# EAGLE design Fog_DRL_Cam (EAGLE 8.2.2)
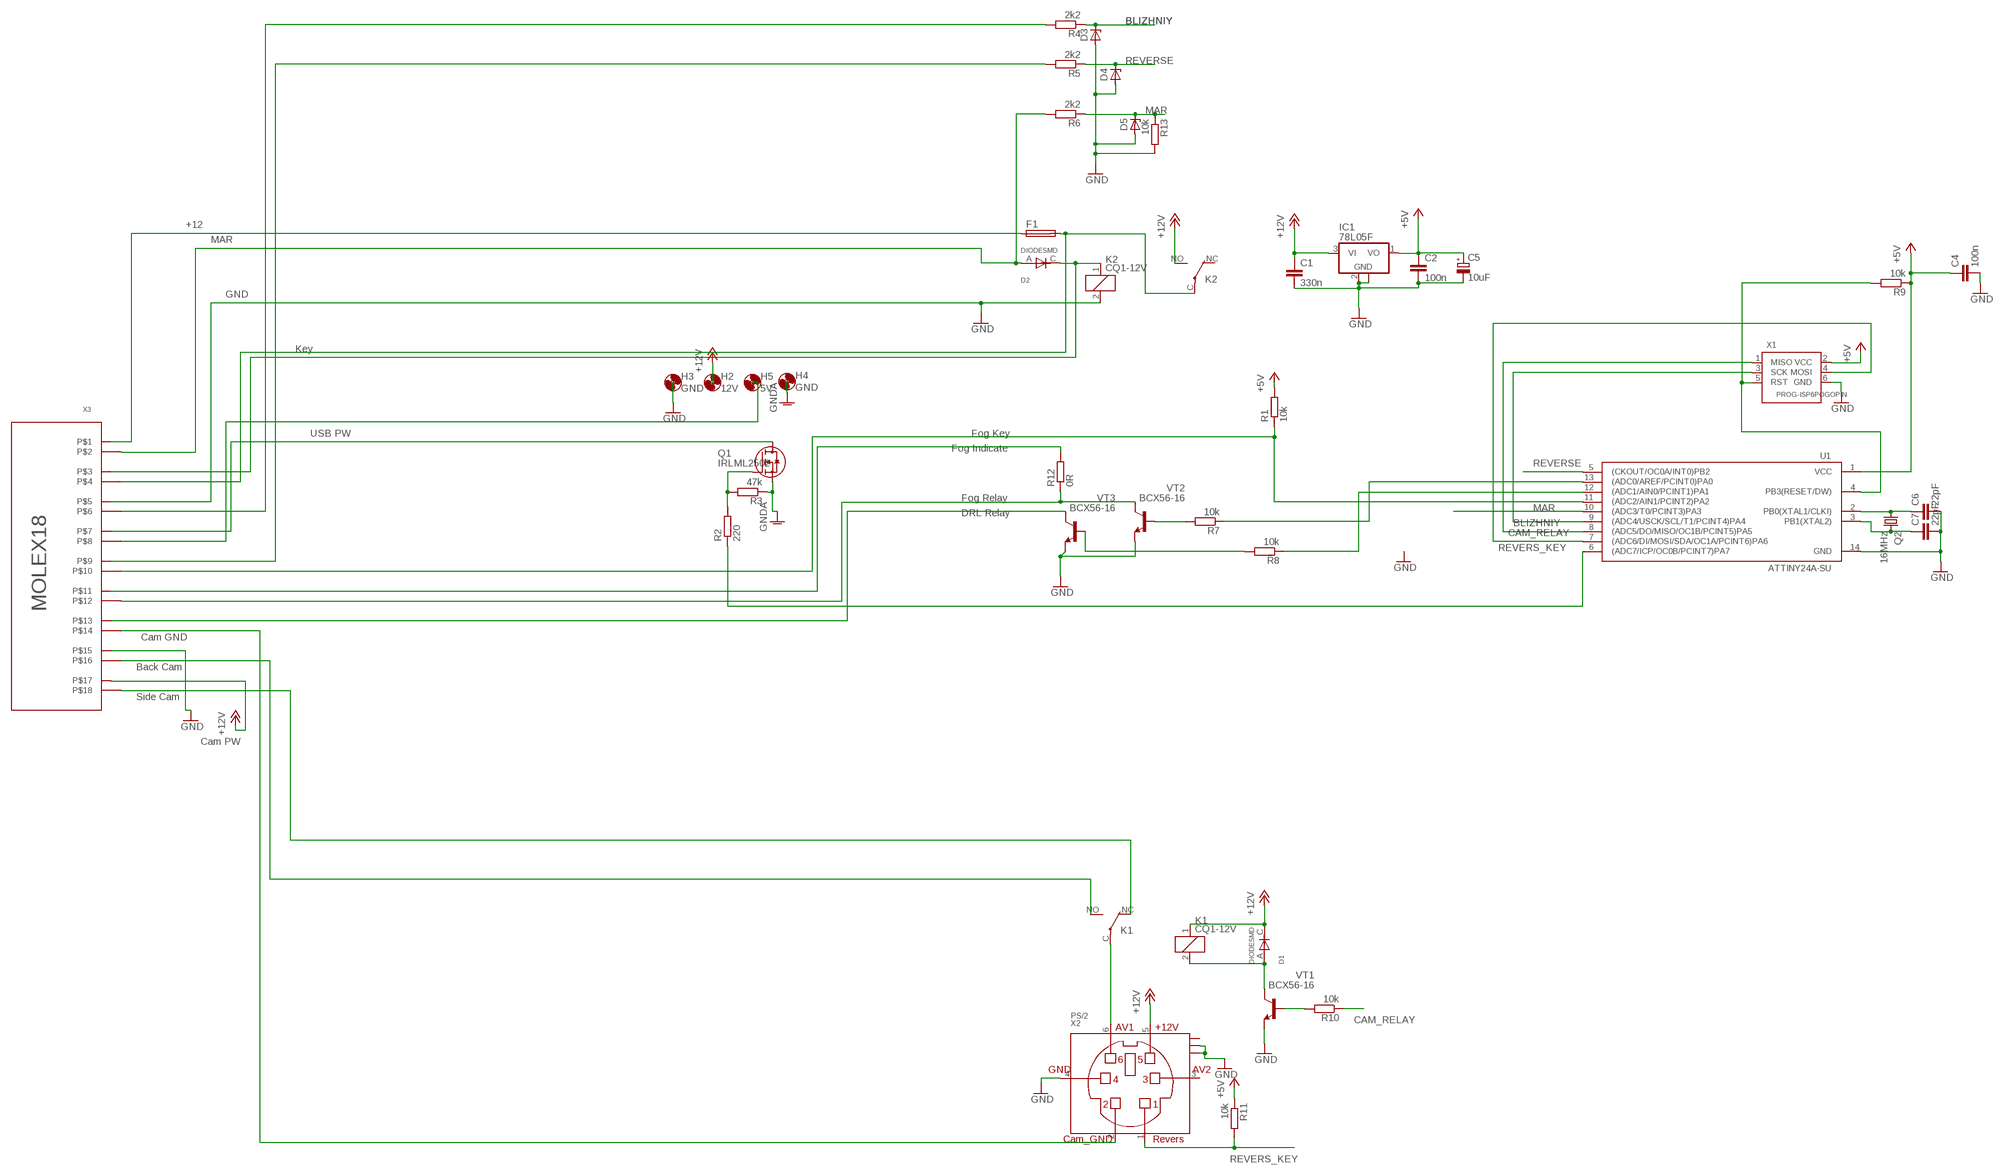
[diagram p0: schematic, sheet 1]

## Parts
C1  330n  C-EUC0805  [C0805]
C2  100n  C-EUC0603  [C0603]
C4  100n  C-EUC0603  [C0603]
C5  10uF  CPOL-EUCT3216  [CT3216]
C6  22pF  C-EUC0603  [C0603]
C7  22pF  C-EUC0603  [C0603]
D1  DIODESMD  [DO214AC]
D2  DIODESMD  [DO214AC]
D3  ZENER-DIODESOD80C  [SOD80C]
D4  ZENER-DIODESOD80C  [SOD80C]
D5  ZENER-DIODESOD80C  [SOD80C]
F1  SH22,5A  [SH22,5A]
H2  12V  MOUNT-HOLE3.0  [3,0]
H3  GND  MOUNT-HOLE3.0  [3,0]
H4  GND  MOUNT-HOLE3.0  [3,0]
H5  5V  MOUNT-HOLE3.0  [3,0]
IC1  78L05F  [SOT89]
K1  CQ1-12V  [CQ1]
K2  CQ1-12V  [CQ1]
Q1  IRLML2502  SI2302  [SOT-23-GSD]
Q2  16MHz  CRYSTALHC49S  [HC49/S]
R1  10k  R-EU_R0603  [R0603]
R2  220  R-EU_R0603  [R0603]
R3  47k  R-EU_R0603  [R0603]
R4  2k2  R-EU_R0603  [R0603]
R5  2k2  R-EU_R0603  [R0603]
R6  2k2  R-EU_R0603  [R0603]
R7  10k  R-EU_R0603  [R0603]
R8  10k  R-EU_R0603  [R0603]
R9  10k  R-EU_R0603  [R0603]
R10  10k  R-EU_R0603  [R0603]
R11  10k  R-EU_R0603  [R0603]
R12  0R  R-EU_R0603  [R0603]
R13  10k  R-EU_R0603  [R0603]
U1  ATTINY24A-SU  [SO14]
VT1  BCX56-16  [SOT89-BCE]
VT2  BCX56-16  [SOT89-BCE]
VT3  BCX56-16  [SOT89-BCE]
X1  PROG-ISP6POGOPIN  [PROG_POGOPIN]
X2  PS/2  [PS/2]
X3  MOLEX18  [MOLEX18]

## Nets
+5V: C2.1 C4.1 C5.+ IC1.1(VO) R1.2 R9.1 R11.1 U1.1(VCC) X1.2(VCC)
+12V: C1.1 D1.C(KATOD) H2.P$1 IC1.3(VI) K1.1 K2.NO(2:S) X2.5 X3.P$17
BLIZHNIY: D3.C R4.1 U1.9((ADC4/USCK/SCL/T1/PCINT4)PA4) X1.3(SCK)
CAM_RELAY: R10.1 U1.8((ADC5/DO/MISO/OC1B/PCINT5)PA5) X1.1(MISO)
GND: C1.2 C2.2 C4.2 C5.- C6.2 C7.2 D3.A D4.A D5.A H3.P$1 IC1.2(GND) IC1.2@1(GND) K2.2 R13.2 U1.14(GND) VT1.E VT2.E VT3.E X1.6(GND) X2.4 X2.GND0 X2.GND2 X3.P$5 X3.P$15
GNDA: H4.P$1 Q1.S R3.1
MAR: D5.C R6.1 R13.1 U1.10((ADC3/T0/PCINT3)PA3)
N$1: K1.NO(2:S) X3.P$16
N$2: R12.2 X3.P$11
N$3: X2.2 X3.P$14
N$4: K1.C(2:P) X2.6
N$5: D1.A(ANOD) K1.2 VT1.C VT1.C@1(C)
N$6: F1.1 X3.P$1
N$7: H5.P$1 X3.P$8
N$8: Q1.D X3.P$7
N$11: F1.2 K2.C(2:P) X3.P$4
N$12: D2.C(KATOD) K2.1 X3.P$3
N$13: D2.A(ANOD) R6.2 X3.P$2
N$14: R2.1 U1.6((ADC7/ICP/OC0B/PCINT7)PA7)
N$15: VT3.C VT3.C@1(C) X3.P$13
N$16: R12.1 VT2.C VT2.C@1(C) X3.P$12
N$17: R8.1 U1.12((ADC1/AIN0/PCINT1)PA1)
N$18: R7.1 U1.13((ADC0/AREF/PCINT0)PA0)
N$19: R1.1 U1.11((ADC2/AIN1/PCINT2)PA2) X3.P$10
N$20: Q1.G R2.2 R3.2
N$21: R5.2 X3.P$9
N$22: R4.2 X3.P$6
N$25: R7.2 VT2.B
N$26: R8.2 VT3.B
N$27: C6.1 Q2.1 U1.2(PB0(XTAL1/CLKI))
N$28: R10.2 VT1.B
N$31: K1.NC(2:O) X3.P$18
N$38: R9.2 U1.4(PB3(RESET/DW)) X1.5(RST)
N$39: C7.1 Q2.2 U1.3(PB1(XTAL2))
REVERS_KEY: R11.2 U1.7((ADC6/DI/MOSI/SDA/OC1A/PCINT6)PA6) X1.4(MOSI) X2.1
REVERSE: D4.C R5.1 U1.5((CKOUT/OC0A/INT0)PB2)
Unconnected: K2.NC(2:O) X2.3 X2.GND1

## Notes on the sheet
- +12
- MAR
- GND
- Key
- USB PW | Fog Key
- Fog Indicate
- Fog Relay
- DRL Relay
- Cam GND
- Back Cam
- Side Cam
- Cam PW

## Library data of the parts
C1 C2 C4 C6 C7 = rcl:C-EU: CAPACITOR, European symbol
C5 = rcl:CPOL-EU: POLARIZED CAPACITOR, European symbol
D1 D2 = usb:DIODE: DIODE
D3-D5 = diode:ZENER-DIODE: Z-Diode
F1 = fuse:SH22,5A: FUSE HOLDER grid 22,5mm, isolated cap OGN0031 8201, Schurter (Buerklin); MPN: 0031.7701.11; OC_FARNELL: unknown; OC_NEWARK: 04F1224
H2-H5 = holes:MOUNT-HOLE: MOUNTING HOLE with drill center marker
IC1 = linear:78L*: POSITOIV-VOLTAGE REGULATORS Output up to 100 mA Source: Datasheet <http://focus.ti.com/lit/ds/symlink/ua78l05.pdf>
K1 K2 = relay:CQ1-12V: AUTOMOTIVE QUIET RELAY NAiS Source: http://www.mew-europe.com/.. en_ds_61208_0000.pdf; OC_FARNELL: unknown; OC_NEWARK: unknown
Q1 = usb:SI2302: N-канальный полевик
Q2 = crystal:CRYSTAL: CRYSTAL; OC_FARNELL: 1667008; OC_NEWARK: unknown
R1-R13 = rcl:R-EU_: RESISTOR, European symbol
U1 = usb:ATTINY24A: ATTiny24A ATTiny44A ATTiny84A
VT1-VT3 = usb:BCX56-16
X1 = usb:PROG-ISP
X2 = usb:PS/2: MINI DIN JACK DIP 90° WITH SHIELD
X3 = usb:MOLEX18

## Board
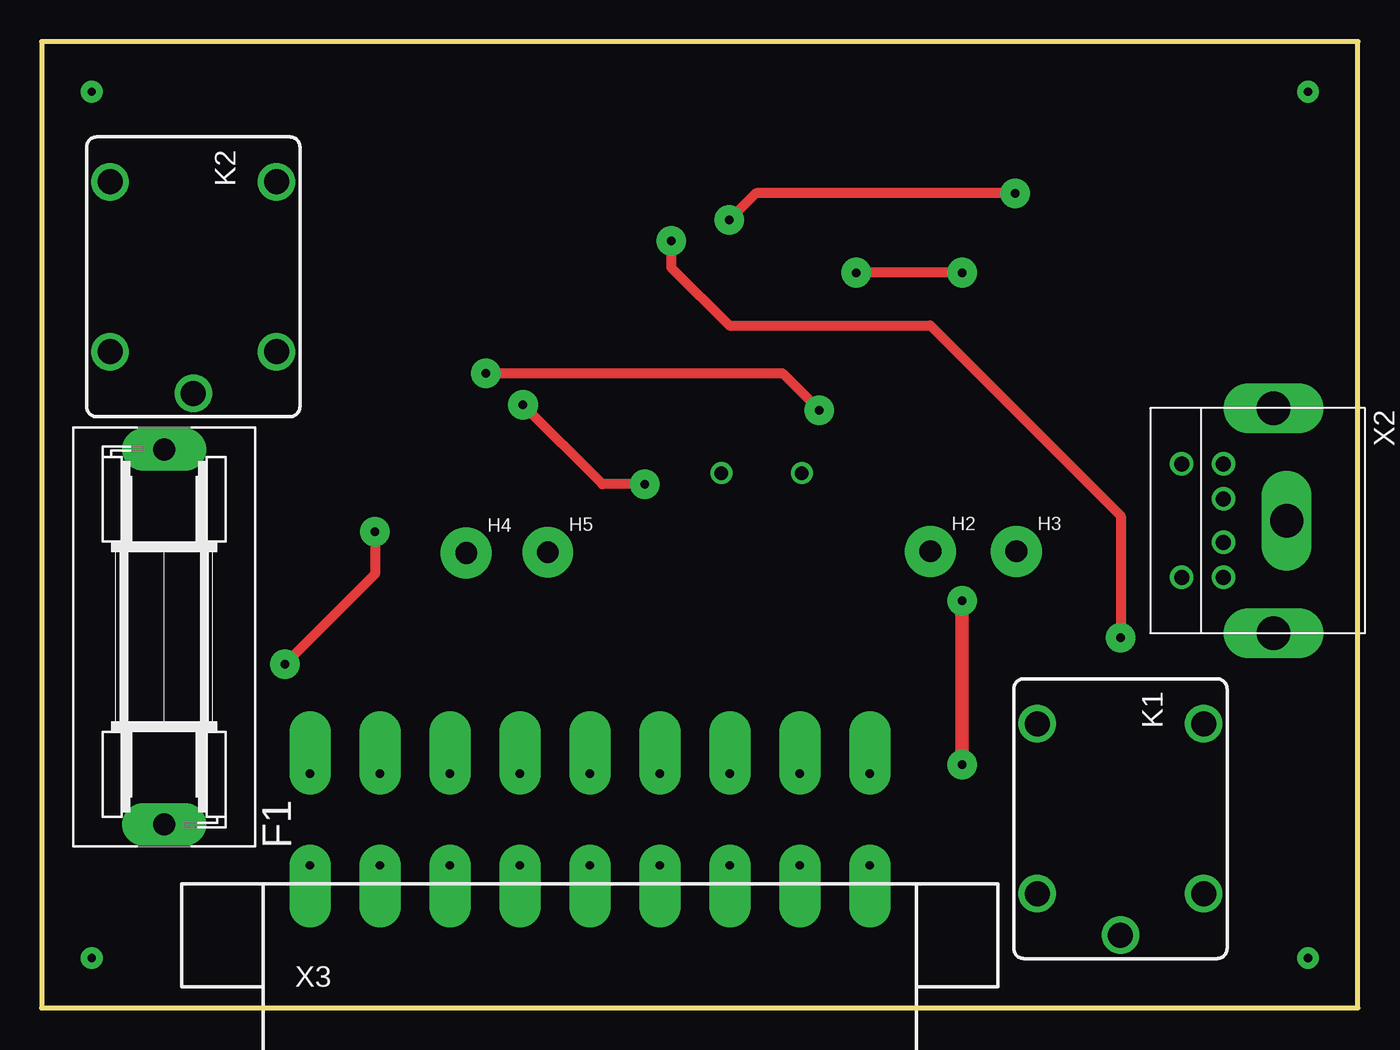
[diagram p1: board, top side]
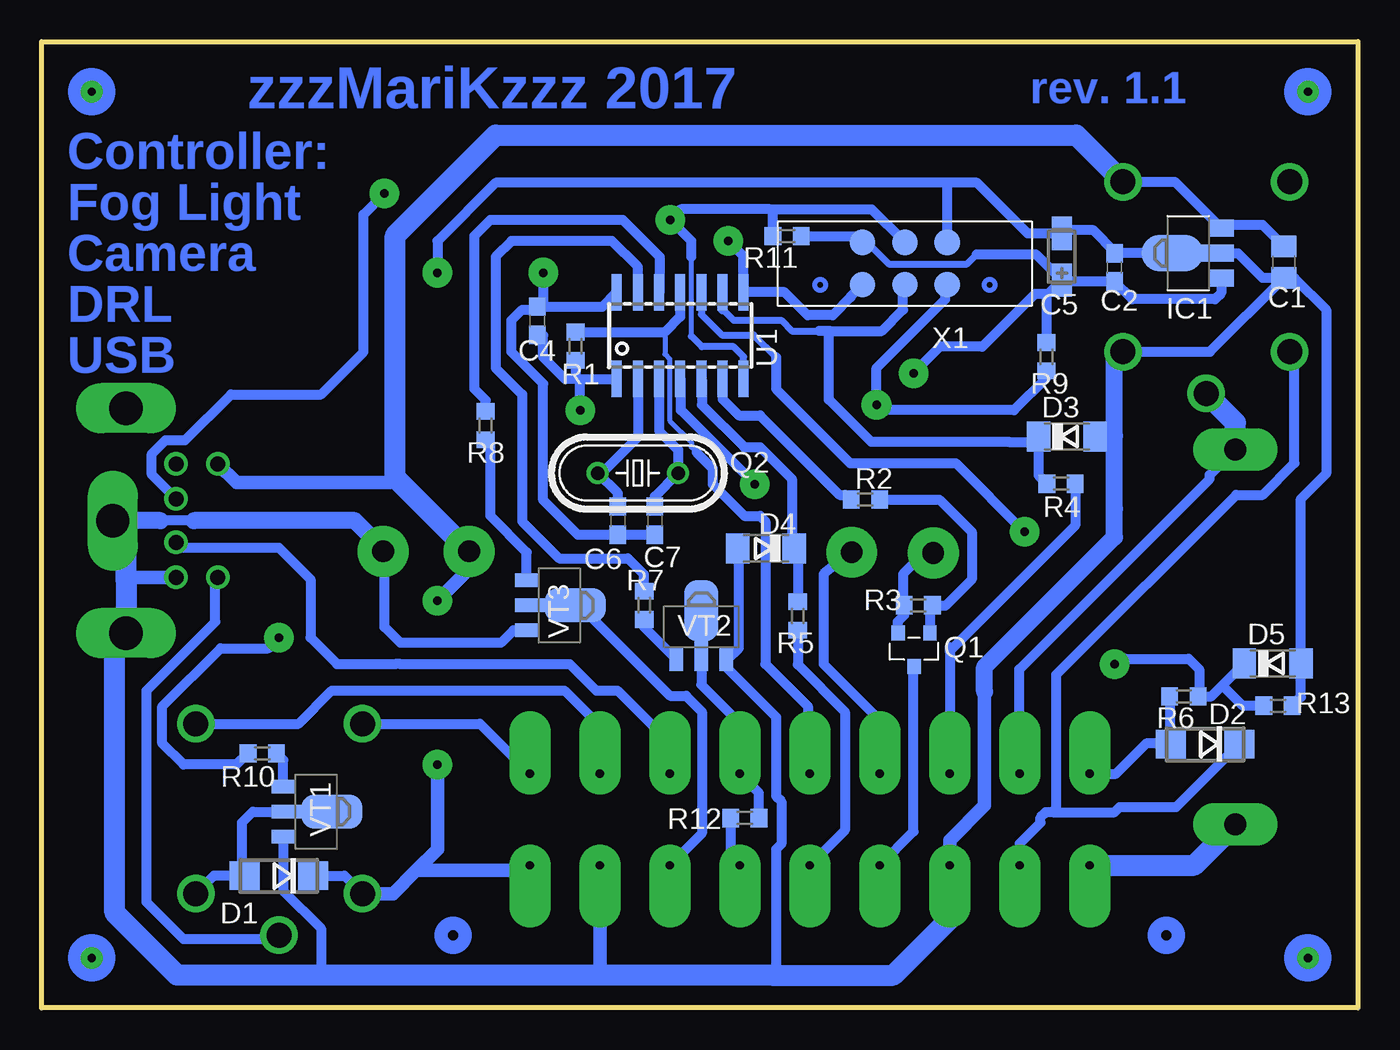
[diagram p2: board, bottom side, seen from below]

Size 79 x 58 mm. Coordinates in mm from the lower left corner, seen from the top.
Outline: 0,0 79,0 79,58 0,58 0,0
Copper layers (1*16): Top 0.035mm / dielectric 1.5mm / Bottom 0.035mm
Design rules "default *": minimum track width 12mil, minimum drill 0.5mm, track to track 12mil, track to pad 12mil, pad to pad 16mil, via to via 16mil, smd to smd 6mil, copper to edge 40mil, drill to drill 16mil, minimum pad ring 10mil, minimum via ring 8mil, stop-mask expansion 4mil, vias tented up to drill 0mil, thermal gap 10mil

### Footprints (pad centres in the part's own frame; a part is rotated, then mirrored left to right if it is on the bottom)
C0805 = smd 1.3 x 1.5: 1 -0.95,0; 2 0.95,0
C0603 = smd 1.1 x 1: 1 -0.85,0; 2 0.85,0
CT3216 = smd 2 x 1.2: + -1.4,0; - 1.4,0
DO214AC = smd 1.8 x 1.7: A 2.05,0; C -2.05,0
SOD80C = smd 1.4 x 1.8: A 1.7,0; C -1.7,0
SH22,5A = drill 1.321 pad 2.54 long: 1 -11.252,0; 2 11.252,0
3,0 = drill 1.3 pad 3.048: P$1 0,0
SOT89 = smd 1 x 1.5: 1 -1.499,-1.981; 3 1.499,-1.981 | smd 1 x 2: 2 0,-1.727 | smd 2.2 x 3.7: 2@1 0,0.94
CQ1 = drill 1.5: 1 4.5,-5; 2 4.5,5; C 7,0; NC -5.7,-5; NO -5.7,5
SOT-23-GSD = smd 0.8 x 0.9: D 0,2; G -0.95,0; S 0.95,0
HC49/S = drill 0.813: 1 -2.413,0; 2 2.413,0
R0603 = smd 1 x 1.1: 1 -0.85,0; 2 0.85,0
SO14 = smd 0.6 x 2.2: 1 -3.81,-2.6; 2 -2.54,-2.6; 3 -1.27,-2.6; 4 0,-2.6; 5 1.27,-2.6; 6 2.54,-2.6; 7 3.81,-2.6; 8 3.81,2.6; 9 2.54,2.6; 10 1.27,2.6; 11 0,2.6; 12 -1.27,2.6; 13 -2.54,2.6; 14 -3.81,2.6
SOT89-BCE = smd 0.8 x 1.4: B -1.499,-1.981; E 1.499,-1.981 | smd 0.8 x 1.9: C 0,-1.727 | smd 2.032 x 3.65: C@1 0,0.94
PROG_POGOPIN = smd 1.524 x 1.524: 1 0,7.62; 2 2.54,7.62; 3 0,5.08; 4 2.54,5.08; 5 0,2.54; 6 2.54,2.54
PS/2 = drill 0.9: 1 5.45,4.4; 2 8.05,4.4; 3 3.35,4.4; 4 10.15,4.4; 5 3.35,1.9; 6 10.15,1.9 | drill 2 long: GND0 13.5,7.4; GND1 0,7.4; GND2 6.75,8.2
MOLEX18 = drill 0.5 pad 2.5 offset: P$1 -16.8,0; P$2 -16.8,5.5; P$3 -12.6,0; P$4 -12.6,5.5; P$5 -8.4,0; P$6 -8.4,5.5; P$7 -4.2,0; P$8 -4.2,5.5; P$9 0,0; P$10 0,5.5; P$11 4.2,0; P$12 4.2,5.5; P$13 8.4,0; P$14 8.4,5.5; P$15 12.6,0; P$16 12.6,5.5; P$17 16.8,0; P$18 16.8,5.5

### Placement (x,y rotation side)
C1  4.45,44.77 270 bottom
C2  14.61,44.45 90 bottom
C4  49.25,41.24 90 bottom
C5  17.78,45.09 90 bottom
C6  44.41,29.24 270 bottom
C7  42.19,29.24 270 bottom
D1  64.77,7.94 180 bottom
D2  9.18,15.84 180 bottom
D3  17.46,34.29 0 bottom
D4  35.53,27.59 180 bottom
D5  5.11,20.67 0 bottom
F1  7.35,22.27 90 top
H2  53.34,27.4 0 top
H3  58.5,27.4 0 top
H4  25.48,27.31 0 top
H5  30.38,27.36 0 top
IC1  10.19,45.3 90 bottom
K1  64.75,11.36 270 top
K2  9.1,43.88 270 top
Q1  26.64,22.51 180 bottom
Q2  43.21,32.1 0 bottom
R1  46.95,39.72 270 bottom
R2  29.56,30.52 0 bottom
R3  26.39,24.16 0 bottom
R4  17.81,31.47 0 bottom
R5  33.62,23.53 270 bottom
R6  10.45,18.7 180 bottom
R7  42.83,24.16 270 bottom
R8  52.35,34.96 270 bottom
R9  18.7,39.09 270 bottom
R10  65.75,15.28 0 bottom
R11  34.26,46.32 180 bottom
R12  36.8,11.39 180 bottom
R13  4.79,18.13 0 bottom
U1  40.67,40.36 0 bottom
VT1  62.51,11.78 270 bottom
VT2  39.4,22.89 0 bottom
VT3  47.91,24.16 270 bottom
X1  22.11,43.41 90 bottom
X2  66.53,36 270 top
X3  32.9,8.56 0 top

### Tracks (layer width: path | path; a pad name or v marks a point on that pad's centre or on a via)
+5V  (via drill 0.51 pad 1.78)
  Top 0.61: v46.67,35.88 44.45,38.1 v26.67,38.1
  Bottom 0.406: X1.2 29.46,45.95 28.16,44.65 23.46,44.65 22.87,45.24
  Bottom 0.61: IC1.1 8.21,42.91 8.57,42.55 13.55,42.55 C2.1 17.7,43.6 C5.+ | 46.75,37.76 U1.1 | 46.75,37.76 47.6,37.76 48.9,39.05 48.9,40.36 C4.1 | v46.67,35.88 46.67,37.68 46.75,37.76 | 18.7,42.77 R9.1 | 18.7,42.77 C5.+ | 18.7,42.77 18.79,42.86 19.37,42.86 22.54,39.69 25.08,39.69 v26.67,38.1 | R11.1 30.1,46.32 X1.2 | 22.87,45.24 19.33,45.24 C5.+ | R1.2 46.95,37.97 46.75,37.76
+12V  (via drill 0.51 pad 1.78)
  Top 0.813: v55.24,24.45 v55.24,14.61
  Bottom 0.61: D1.C 60.83,7.94 K1.1 | K2.NO 10.99,49.58 IC1.3 8.02,46.99 5.71,46.99 C1.1
  Bottom 0.813: K1.1 57.91,6.86 56.52,8.26 | 56.52,8.26 50,8.26 X3.P$17 | H2.P$1 53.34,26.35 v55.24,24.45 | v55.24,14.61 55.24,9.53 56.52,8.26 | X2.5 67.31,31.52 58.1,31.52 57.78,31.84
  Bottom 1.27: H2.P$1 57.78,31.84 57.78,46.35 51.75,52.39 16.91,52.39 K2.NO
BLIZHNIY
  Bottom 0.406: 38.13,41.94 37.47,41.27 34.61,41.27 33.97,40.64 32.32,40.64
  Bottom 0.61: 38.13,41.94 U1.9 | 31.7,40.64 32.32,40.64 | 31.7,40.64 28.57,40.64 27.3,41.91 27.3,43.3 X1.3 | 31.7,40.64 31.75,40.59 31.75,36.51 29.21,33.97 21.27,33.97 20.95,33.97 19.48,33.97 D3.C 19.16,31.97 R4.1
CAM_RELAY  (via drill 0.51 pad 1.78)
  Top 0.61: v64.77,22.23 64.77,29.53 53.34,40.96 41.27,40.96 37.78,44.45 v37.78,46.04
  Bottom 0.61: R10.1 66.64,15.28 67.31,14.61 70.48,14.61 71.75,15.88 71.75,18.1 68.26,21.59 65.41,21.59 v64.77,22.23 | X1.1 30.44,42.7 30.44,42.65 31.51,41.58 33.03,41.58 34.4,42.96 U1.8 36.86,45.12 v37.78,46.04
GND  (via drill 0.51 pad 1.78)
  Top 0.61: v55.24,44.13 v48.9,44.13
  Bottom 0.61: R13.2 3.41,18.66 D5.A 3.41,30.56 1.91,32.07 1.91,41.91 3.81,43.82 C1.2 | VT1.E 64.49,7.03 62.23,4.76 62.23,1.98 62.22,1.97 | C4.2 45.35,42.09 U1.14 | C4.2 49.11,41.91 50.16,41.91 50.8,41.27 50.8,39.37 48.9,37.47 48.9,30.48 46.81,28.39 C6.2 C7.2 42.06,28.26 | 37.9,20.76 VT2.E | 24.54,45.95 X1.6 24.65,49.52 24.64,49.53 | X2.GND2 74.69,29.21 | 14.82,30.16 14.61,29.95 | v48.9,44.13 48.9,42.13 C4.2 | VT3.E 50.68,22.66 51.44,21.91 57.47,21.91 58.42,22.86 58.42,27.32 H3.P$1 | 24.64,49.53 22.86,49.53 19.82,46.48 C5.- 17.59,46.67 15.88,46.67 14.61,45.4 C2.2 IC1.2@1 IC1.2 7.2,45.3 5.71,43.81 C1.2 | VT2.E 37.82,20.91 37.15,21.59 37.15,27.51 D4.A | D3.A 14.67,34.29 14.61,34.35 | v55.24,44.13 55.24,46.04 51.75,49.53 24.64,49.53 | VT2.E 37.9,20.44 34.92,17.46 34.92,12.7 34.61,12.38 34.61,9.84 34.92,9.53 34.92,2.25 35.21,1.97 | K2.2 8.88,39.38 C1.2 | 69.85,29.25 71.88,29.25
  Bottom 0.813: X3.P$5 24.5,10.04 22.4,12.14 22.4,18.99 | X2.4 73.76,25.85 73.93,25.68 | X3.P$15 45.5,1.98 45.49,1.97
  Bottom 1.016: 22.4,18.99 22.4,20.46 14.61,28.26 14.61,29.95 14.61,34.35 14.61,38.88 K2.2 | H3.P$1 58.5,27.54 60.21,29.25 69.85,29.25 | 71.88,29.25 X2.GND2
  Bottom 1.27: X3.P$5 24.5,5.34 27.88,1.97 35.21,1.97 45.49,1.97 62.22,1.97 70.87,1.97 74.61,5.71 74.61,21.82 X2.GND0 73.93,25.68 73.93,28.45 X2.GND2
GNDA
  Bottom 0.61: H4.P$1 26.03,27.31 27.3,26.04 27.3,24.23 R3.1 27.23,23.57 27.62,23.18 27.62,22.54 Q1.S
MAR  (via drill 0.51 pad 1.78)
  Top 0.61: v20,28.57 20,26.04 v14.61,20.64
  Bottom 0.406: U1.10 39.4,41.62 38.18,40.4 36.27,40.4 34.92,39.05
  Bottom 0.61: 8.13,19.36 8.79,18.7 R6.1 9.53,18.77 9.53,20.32 10.16,20.95 13.97,20.95 14.29,20.64 v14.61,20.64 | 8.13,19.36 D5.C | R13.1 6.9,18.13 8.13,19.36 | 34.92,39.05 34.92,37.15 30.48,32.7 24.13,32.7 v20,28.57
N$1
  Bottom 0.61: K1.NO 63.59,17.06 61.59,19.05 47.62,19.05 45.4,16.83 45.4,14.15 X3.P$16
N$2
  Bottom 0.61: R12.2 37.65,9.11 X3.P$11
N$3
  Bottom 0.61: X3.P$14 41.3,15.9 44.45,19.05 45.72,19.05 47.31,20.64 57.47,20.64 57.78,20.64 61.28,20.64 62.87,22.23 62.87,25.72 64.77,27.62 70.61,27.62 X2.2
N$4
  Bottom 0.61: K1.C 64.98,4.13 70.48,4.13 72.71,6.35 72.71,19.05 68.58,23.18 68.58,25.7 X2.6
N$5
  Bottom 0.61: K1.2 68.67,7.94 D1.A 66.99,8.11 66.99,11.11 66.33,11.78 VT1.C VT1.C@1
N$6
  Bottom 1.27: X3.P$1 9.82,8.56 F1.1
N$7
  Bottom 0.61: H5.P$1 30.43,27.36 32.07,26.04 32.07,20.64 28.57,17.14 28.57,14.18 X3.P$8
N$8
  Bottom 0.61: X3.P$7 26.67,10.59 26.67,20.48 Q1.D
N$9  (via drill 0.5 pad 1.3)
  other vias: 76,55
N$10  (via drill 0.5 pad 1.3)
  other vias: 76,3
N$11
  Bottom 0.61: X3.P$4 20.32,14.08 20.32,20.32 8.89,31.75 8.89,31.99 F1.2
  Bottom 1.27: F1.2 7.35,35.13 K2.C
N$12
  Bottom 0.61: X3.P$3 20.3,9.86 19.05,11.11 19.05,11.43 18.73,11.75 18.31,11.75 | 18.31,11.75 14.61,11.75 14.29,12.06 10.9,12.06 D2.C | 18.31,11.75 18.1,11.96 18.1,20 7.3,30.8 5.71,30.8 3.81,32.7 3.81,39.09 K2.1
N$13
  Bottom 0.61: X3.P$2 14.52,14.06 12.7,15.88 11.26,15.88 | 11.26,15.88 D2.A | R6.2 11.29,15.91 11.26,15.88
N$14
  Bottom 0.61: R2.1 30.45,30.48 30.76,30.8 31.11,30.8 35.88,35.56 37.15,35.56 38.13,36.55 U1.6
N$15
  Bottom 0.61: X3.P$13 39.37,10.49 39.37,17.78 40.32,18.73 41.27,18.73 46.7,24.16 VT3.C@1 VT3.C
N$16
  Bottom 0.61: R12.1 35.95,12.9 X3.P$12 37.15,14.11 37.15,17.14 39.4,19.4 VT2.C VT2.C@1
N$17
  Bottom 0.61: R8.1 52.35,36.48 53.02,37.15 53.02,46.35 52.07,47.31 44.13,47.31 41.91,45.09 41.91,42.99 U1.12
N$18
  Bottom 0.61: 43.18,42.99 U1.13 43.21,44.48 44.77,46.04 50.8,46.04 51.75,45.09 51.75,38.42 50.16,36.83 50.16,29.21 47.94,26.99 43.81,26.99 42.86,26.04 42.86,25.05 R7.1
N$19
  Bottom 0.305: 41.59,40.57 41.59,39.24 41.3,38.95 41.3,35.27 40.01,33.97 40.01,33.66 39.69,33.34
  Bottom 0.61: X3.P$10 33.02,14.18 33.02,18.1 35.56,20.64 35.56,29.21 35.88,29.53 36.83,29.53 38.73,31.43 38.73,32.38 39.69,33.34 | R1.1 41.59,40.57 40.67,41.49 U1.11
N$20
  Bottom 0.61: Q1.G 25.69,24.01 25.57,24.13 | 25.57,24.13 R3.2 | R2.2 25.12,30.52 23.18,28.57 23.18,25.72 24.77,24.13 25.57,24.13
N$21
  Bottom 0.61: R5.2 33.62,20.6 30.8,17.78 30.8,10.66 X3.P$9
N$22
  Bottom 0.61: 24.5,21.42 X3.P$6 | 24.5,21.42 24.5,21.64 | R4.2 16.96,28.96 24.5,21.42
N$23  (via drill 0.5 pad 1.3)
  other vias: 3,55
N$24  (via drill 0.5 pad 1.3)
  other vias: 3,3
N$25
  Bottom 0.61: R7.2 42.83,22.84 VT2.B
N$26
  Bottom 0.61: VT3.B 49.89,27.35 52.07,29.53 52.07,33.83 R8.2
N$27
  Bottom 0.61: U1.2 43.18,37.73 43.18,34.29 45.37,32.1 Q2.1 44.41,30.89 C6.1
N$28
  Bottom 0.61: VT1.B 64.49,14.86 R10.2
N$31
  Bottom 0.61: K1.NC 52.7,17.06 X3.P$18
N$38  (via drill 0.51 pad 1.78)
  Top 0.61: v36.2,31.43 33.66,31.43 v28.89,36.2
  Bottom 0.61: v36.2,31.43 40.64,35.88 40.64,37.73 U1.4 | 18.88,38.42 R9.2 18.7,37.82 20.64,35.88 28.57,35.88 v28.89,36.2 28.89,38.42 24.77,42.55 24.77,43.3 X1.5
N$39
  Bottom 0.61: C7.1 42.19,30.71 Q2.2 40.8,33.5 41.94,34.64 U1.3
REVERS_KEY  (via drill 0.51 pad 1.78)
  Top 0.61: v58.42,48.9 42.86,48.9 v41.27,47.31
  Bottom 0.305: 40.01,40.32 40.01,41.73 40.01,44.18 40.01,44.19 40.01,45.09
  Bottom 0.406: U1.7 36.86,39.09 37.47,39.69 39.37,39.69 40.01,40.32
  Bottom 0.61: X1.4 29.18,47.94 35.27,47.94 | X2.1 72.39,32.01 72.39,33.24 71.56,34.07 70.39,34.07 67.63,36.83 62.23,36.83 59.69,39.37 59.69,47.62 v58.42,48.9 | 35.27,47.94 40.64,47.94 v41.27,47.31 40.01,46.04 40.01,45.09 | R11.2 35.11,47.78 35.27,47.94
REVERSE
  Bottom 0.61: U1.5 39.37,37.73 39.37,36.2 36.83,33.66 35.88,33.66 33.97,31.75 33.97,27.73 D4.C | R5.1 33.62,27.38 D4.C | 34.15,27.91 D4.C
(copper drawn outside any net)
  shapes: Bottom circle x4

### Text on the board
Bottom: rev. 1.1 | zzzMariKzzz 2017 | Controller: / Fog Light / Camera / DRL / USB